# EAGLE design PIC32_Schematic (EAGLE 7.5.0)
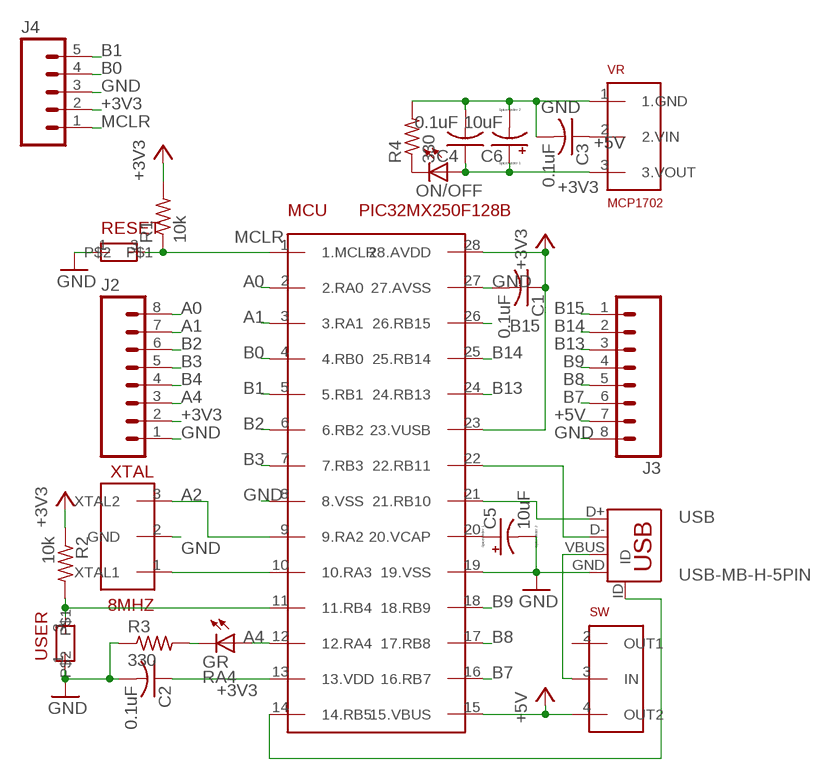
[diagram p0: schematic, sheet 1]

## Parts
8MHZ  XTAL  8MHZ_XTAL  [8MHZ_XTAL]
C1  0.1uF  C-US025-024X044  [C025-024X044]
C2  0.1uF  C-US025-024X044  [C025-024X044]
C3  0.1uF  C-US025-024X044  [C025-024X044]
C4  0.1uF  C-US025-024X044  [C025-024X044]
C5  10uF  CPOL-USE2.5-6  [E2,5-6]
C6  10uF  CPOL-USE2.5-6  [E2,5-6]
GR  RA4  LED3MM  [LED3MM]
J2  M08  [1X08_ROUND]
J3  M08  [1X08_ROUND]
J4  M05PTH  [1X05]
MCU  PIC32MX250F128B  [DIL28-3]
ON/OFF  LED3MM  [LED3MM]
R1  10k  R-US_0207/10  [0207/10]
R2  10k  R-US_0207/10  [0207/10]
R3  330  R-US_0207/10  [0207/10]
R4  330  R-US_0207/10  [0207/10]
RESET  PUSH-BUTTON  [PUSH-BUTTON]
SW  SLIDE_SWITCH  [SLIDE_SWITCH]
USB  USB-MB-H-5PIN  [USB-MB-H]
USER  PUSH-BUTTON  [PUSH-BUTTON]
VR  MCP1702  [TO92]

## Nets
+3V3: C1.1 C2.1 C4.1 C6.+ J2.2 J4.2 MCU.13(13.VDD) MCU.23(23.VUSB) MCU.28(28.AVDD) ON/OFF.A R1.2 R2.1 VR.3(3.VOUT)
+5V: C3.1 J3.7 MCU.15(15.VBUS) SW.4(OUT2) VR.2(2.VIN)
A0: J2.8 MCU.2(2.RA0)
A1: J2.7 MCU.3(3.RA1)
A2: 8MHZ.3(XTAL2) MCU.9(9.RA2)
A3: 8MHZ.1(XTAL1) MCU.10(10.RA3)
A4: GR.A J2.3 MCU.12(12.RA4)
B0: J4.4 MCU.4(4.RB0)
B1: J4.5 MCU.5(5.RB1)
B2: J2.6 MCU.6(6.RB2)
B3: J2.5 MCU.7(7.RB3)
B4: J2.4 MCU.11(11.RB4) R2.2 USER.3
B7: J3.6 MCU.16(16.RB7)
B8: J3.5 MCU.17(17.RB8)
B9: J3.4 MCU.18(18.RB9)
B13: J3.3 MCU.24(24.RB13)
B14: J3.2 MCU.25(25.RB14)
B15: J3.1 MCU.26(26.RB15)
D+: MCU.21(21.RB10) USB.D+
D-: MCU.22(22.RB11) USB.D-
GND: 8MHZ.2(GND) C1.2 C2.2 C3.2 C4.2 C5.- C6.- J2.1 J3.8 J4.3 MCU.8(8.VSS) MCU.19(19.VSS) MCU.27(27.AVSS) R3.1 R4.2 RESET.1 USB.GND USER.1 VR.1(1.GND)
GREENLED: GR.K(C) R3.2
ID: MCU.14(14.RB5) USB.ID
MCLR: J4.1 MCU.1(1.MCLR) R1.1 RESET.3
N$3: ON/OFF.K(C) R4.1
N$9: C5.+ MCU.20(20.VCAP)
VBUS: SW.3(IN) USB.VBUS
Unconnected: SW.2(OUT1)

## Library data of the parts
8MHZ = ME433:8MHZ_XTAL
C1-C4 = ME433:C-US: CAPACITOR, American symbol
C5 C6 = ME433:CPOL-US: POLARIZED CAPACITOR, American symbol
GR ON/OFF = ME433:LED: LED OSRAM: - CHIPLED LG R971, LG N971, LY N971, LG Q971, LY Q971, LO R971, LY R971 LH N974, LH R974 LS Q976, LO Q976, LY Q976 LO Q996 - Hyper CHIPLED LW Q18S LB Q993, LB Q99A, LB R99A - SideLED LS A670, LO A670, LY A670, LG A670, LP A670 LB A673, LV A673, LT A673, LW A673 LH A674 LY A675 LS A676, LA A676, LO A676, LY A676, LW A676 LS A679, LY A679, LG A679 - Hyper Micro SIDELED® LS Y876, LA Y876, LO Y876, LY Y876 LT Y87S - SmartLED LW L88C, LW L88S LB L89C, LB L89S, LG L890 LS L89K, LO L89K, LY L89K LS L896, LA L896, LO L896, LY L896 - TOPLED LS T670, LO T670, LY T670, LG T670, LP T670 LSG T670, LSP T670, LSY T670, LOP T670, LYG T670 LG T671, LOG T671, LSG T671 LB T673, LV T673, LT T673, LW T673 LH T674 LS T676, LA T676, LO T676, LY T676, LB T676, LH T676, LSB T676, LW T676 LB T67C, LV T67C, LT T67C, LS T67K, LO T67K, LY T67K, LW E67C LS E67B, LA E67B, LO E67B, LY E67B, LB E67C, LV E67C, LT E67C LW T67C LS T679, LY T679, LG T679 LS T770, LO T770, LY T770, LG T770, LP T770 LB T773, LV T773, LT T773, LW T773 LH T774 LS E675, LA E675, LY E675, LS T675 LS T776, LA T776, LO T776, LY T776, LB T776 LHGB T686 LT T68C, LB T68C - Hyper Mini TOPLED® LB M676 - Mini TOPLED Santana® LG M470 LS M47K, LO M47K, LY M47K Source: http://www.osram.convergy.de LUXEON: - LUMILED® LXK2-PW12-R00, LXK2-PW12-S00, LXK2-PW14-U00, LXK2-PW14-V00 LXK2-PM12-R00, LXK2-PM12-S00, LXK2-PM14-U00 LXK2-PE12-Q00, LXK2-PE12-R00, LXK2-PE12-S00, LXK2-PE14-T00, LXK2-PE14-U00 LXK2-PB12-K00, LXK2-PB12-L00, LXK2-PB12-M00, LXK2-PB14-N00, LXK2-PB14-P00, LXK2-PB14-Q00 LXK2-PR12-L00, LXK2-PR12-M00, LXK2-PR14-Q00, LXK2-PR14-R00 LXK2-PD12-Q00, LXK2-PD12-R00, LXK2-PD12-S00 LXK2-PH12-R00, LXK2-PH12-S00 LXK2-PL12-P00, LXK2-PL12-Q00, LXK2-PL12-R00 Source: www.luxeon.com KINGBRIGHT: KA-3528ASYC Source: www.kingbright.com
J2 J3 = ME433:M08: Header 8 Standard 8-pin 0.1" header. Use with straight break away headers (SKU : PRT-00116), right angle break away headers (PRT-00553), swiss pins (PRT-00743), machine pins (PRT-00117), and female headers (PRT-00115).; PROD_ID: CONN-08437
J4 = ME433:M05: Header 5 Standard 5-pin 0.1" header. Use with straight break away headers (SKU : PRT-00116), right angle break away headers (PRT-00553), swiss pins (PRT-00743), machine pins (PRT-00117), and female headers (PRT-00115). Molex polarized connector foot print use with SKU : PRT-08230 with associated crimp pins and housings.
MCU = ME433:PIC32MX250F128B
R1-R4 = ME433:R-US_: RESISTOR, American symbol
RESET USER = ME433:PUSH-BUTTON
SW = ME433:SLIDE_SWITCH
USB = ME433:USB-MB-H-5PIN
VR = ME433:MCP1702

## Board
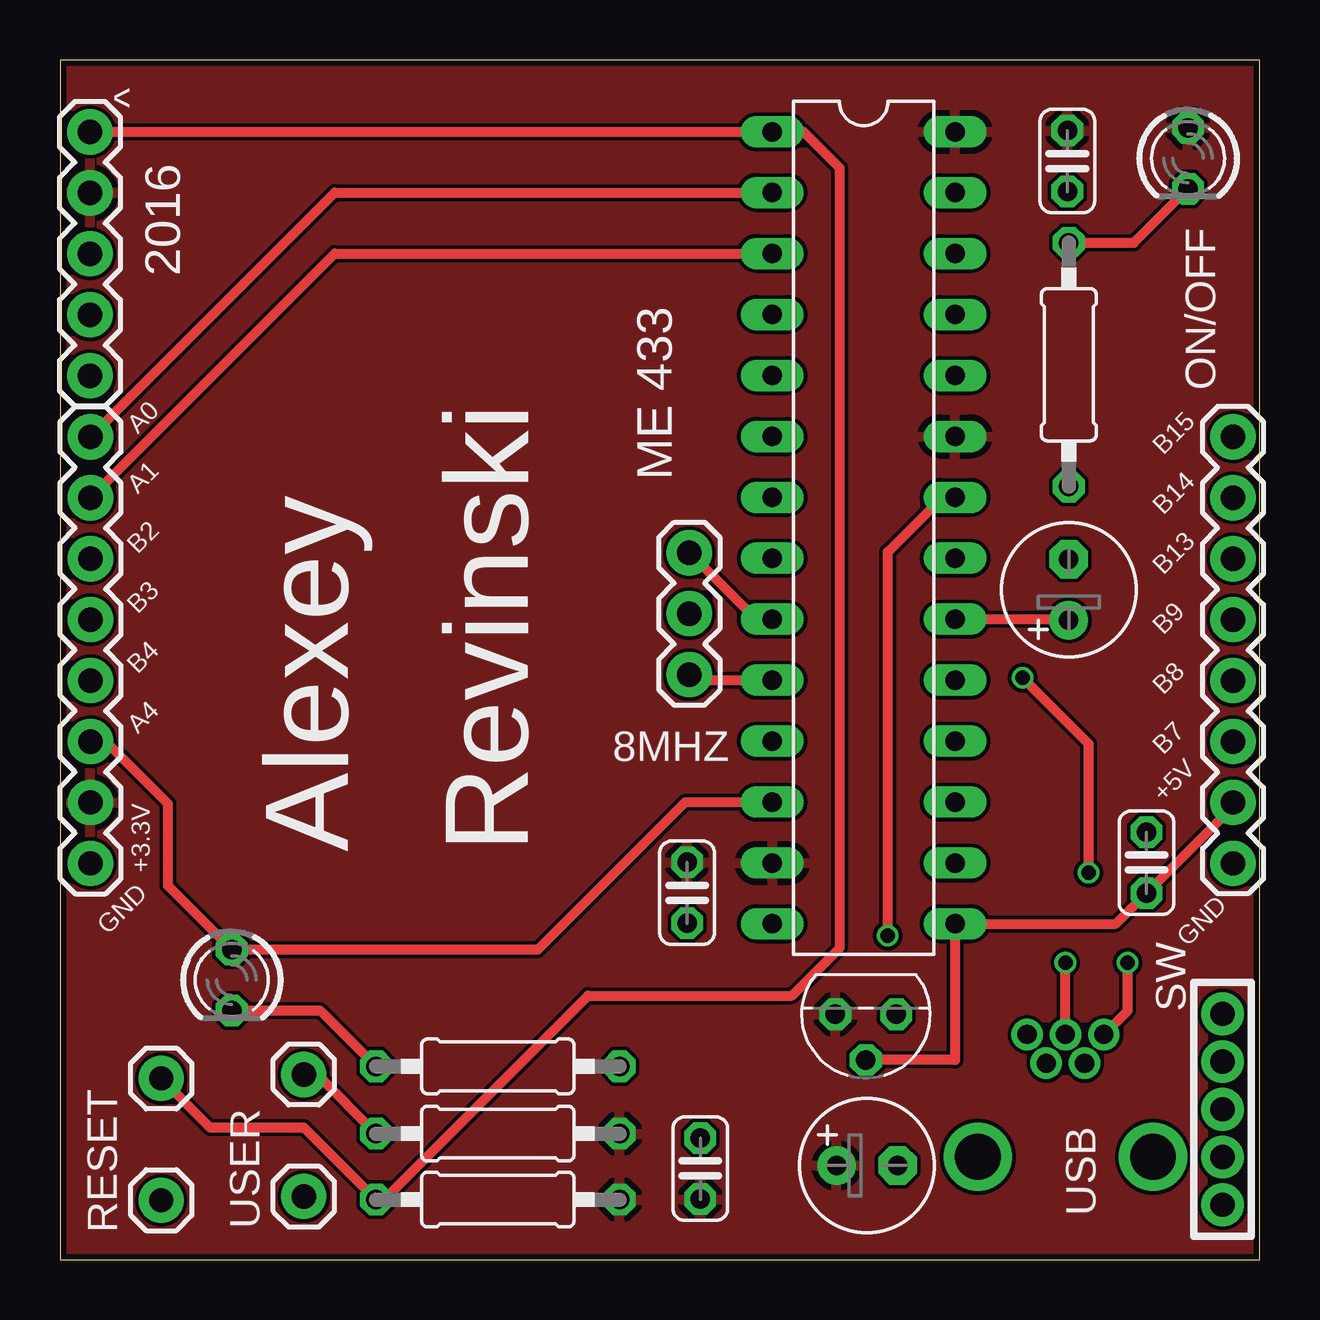
[diagram p1: board, top side]
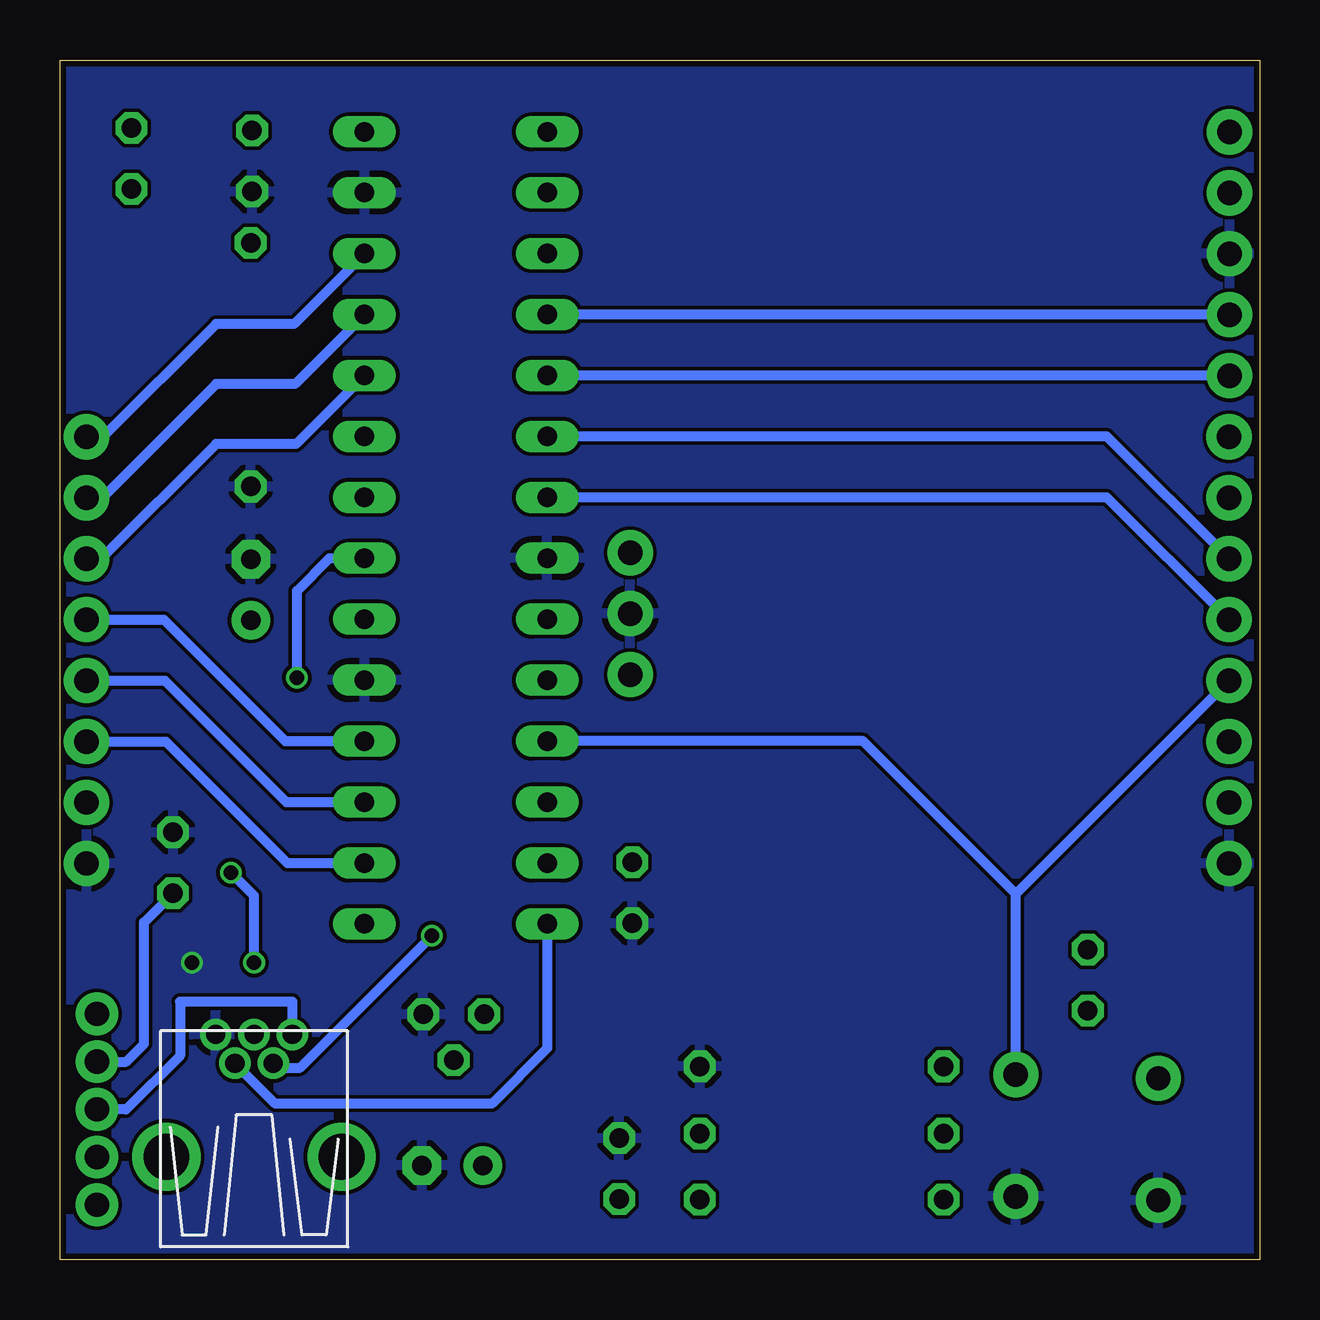
[diagram p2: board, bottom side, seen from below]

Size 50 x 50 mm. Coordinates in mm from the lower left corner, seen from the top.
Outline: 0,0 50,0 50,50 0,50 0,0
Copper layers (1*16): Top 0.035mm / dielectric 1.5mm / GND 0.035mm
Design rules "SeeedStudio_2layer_DRU_no_angle_20140221": minimum track width 6mil, minimum drill 12mil, track to track 6mil, track to pad 6mil, pad to pad 6mil, via to via 6mil, smd to smd 0mil, copper to edge 10mil, drill to drill 10mil, minimum pad ring 10mil, minimum via ring 6mil, stop-mask expansion 2mil, vias tented up to drill 100mil, thermal gap 10mil

### Footprints (pad centres in the part's own frame; a part is rotated, then mirrored left to right if it is on the bottom)
8MHZ_XTAL = drill 1.016 pad 1.88: 1 -2.54,0; 2 0,0; 3 2.54,0
C025-024X044 = drill 0.813 octagon: 1 -1.27,0; 2 1.27,0
E2,5-6 = drill 0.813 pad 1.6: + -1.27,0 | drill 0.813 pad 1.6 octagon: - 1.27,0
LED3MM = drill 0.813 octagon: A -1.27,0; K 1.27,0
1X08_ROUND = drill 1.016 pad 1.88: 1 0,0; 2 2.54,0; 3 5.08,0; 4 7.62,0; 5 10.16,0; 6 12.7,0; 7 15.24,0; 8 17.78,0
1X05 = drill 1.016 pad 1.88: 1 0,0; 2 2.54,0; 3 5.08,0; 4 7.62,0; 5 10.16,0
DIL28-3 = drill 0.813 long: 1 -16.51,-3.81; 2 -13.97,-3.81; 3 -11.43,-3.81; 4 -8.89,-3.81; 5 -6.35,-3.81; 6 -3.81,-3.81; 7 -1.27,-3.81; 8 1.27,-3.81; 9 3.81,-3.81; 10 6.35,-3.81; 11 8.89,-3.81; 12 11.43,-3.81; 13 13.97,-3.81; 14 16.51,-3.81; 15 16.51,3.81; 16 13.97,3.81; 17 11.43,3.81; 18 8.89,3.81; 19 6.35,3.81; 20 3.81,3.81; 21 1.27,3.81; 22 -1.27,3.81; 23 -3.81,3.81; 24 -6.35,3.81; 25 -8.89,3.81; 26 -11.43,3.81; 27 -13.97,3.81; 28 -16.51,3.81
0207/10 = drill 0.813 octagon: 1 -5.08,0; 2 5.08,0
PUSH-BUTTON = drill 1.016 pad 1.88: 1 -2.54,0; 3 2.54,0
SLIDE_SWITCH = drill 1.016 pad 1.778: 1 -3.98,0; 2 -1.99,0; 3 0,0; 4 1.99,0; 5 3.98,0
USB-MB-H = drill 0.8: D+ 5.1,0; D- 3.9,0.8; GND 5.1,-1.6; ID 3.9,-0.8; VBUS 5.1,1.6 | drill 1.9: P$6 0,-3.65; P$7 0,3.65
TO92 = drill 0.813 octagon: 1 -1.27,0; 2 0,1.905; 3 1.27,0

### Placement (x,y rotation side)
8MHZ  26.23,26.92 90 top
C1  41.99,45.79 270 top
C2  26.14,15.29 270 top
C3  45.29,16.54 90 top
C4  26.69,3.79 90 top
C5  42.05,27.92 90 top
C6  33.64,3.92 0 top
GR  7.16,11.65 270 top
J2  1.27,16.51 90 top
J3  48.9,34.29 270 top
J4  1.25,47 270 top
MCU  33.5,30.5 270 top
ON/OFF  47.02,45.9 270 top
R1  18.25,2.5 0 top
R2  18.25,5.25 180 top
R3  18.25,8.05 180 top
R4  42.05,37.3 270 top
RESET  4.22,5.01 90 top
SW  48.46,6.26 90 top
USB  41.91,4.28 90 top
USER  10.16,5.17 90 top
VR  33.59,10.22 180 top

### Tracks (layer width: path | path; a pad name or v marks a point on that pad's centre or on a via)
+3V3
  pour Top: -1,51 -1,-2.5 52,-2.5 52,51.5 -1,51.5
+5V
  Top 0.406: VR.2 37.31,8.31 MCU.15 44.01,13.99 C3.1 45.5,15.5 48.5,18.5 48.5,19 J3.7
  GND 0.406: SW.4 47.25,8.25 46.5,9 46.5,14.06 C3.1
A0
  Top 0.406: J2.8 11.45,44.47 MCU.2
A1
  Top 0.406: MCU.3 11.45,41.93 J2.7
A2
  Top 0.406: 8MHZ.3 29,26.69 MCU.9
A3
  Top 0.406: 8MHZ.1 26.46,24.15 MCU.10
A4
  Top 0.406: MCU.12 26.07,19.07 19.92,12.92 GR.A 4.5,15.58 4.5,19 1.91,21.59 J2.3
B0
  Top 0.406: MCU.4
  GND 0.406: J4.4 MCU.4
B1
  Top 0.406: MCU.5
  GND 0.406: J4.5 MCU.5
B2
  GND 0.406: J2.6 6.37,34.31 MCU.6
B3
  GND 0.406: J2.5 6.37,31.77 MCU.7
B4
  Top 0.406: USER.3 10.71,7.71 R2.2
  GND 0.406: USER.3 10.16,15.24 | 10.16,15.24 J2.4 | 10.16,15.24 16.53,21.61 MCU.11
B7
  GND 0.406: J3.6 45.59,21.59 40.53,16.53 MCU.16
B8
  GND 0.406: J3.5 45.63,24.13 40.57,19.07 MCU.17
B9
  GND 0.406: J3.4 45.67,26.67 40.61,21.61 MCU.18
B13
  GND 0.406: MCU.24 40.16,34 43.5,34 48.29,29.21 J3.3
B14
  GND 0.406: MCU.25 40.2,36.5 43.5,36.5 48.25,31.75 J3.2
B15
  GND 0.406: MCU.26 40.24,39 43.5,39 48.21,34.29 J3.1
D+  (via drill 0.6 pad 0.3)
  Top 0.406: USB.D+ v41.91,12.38 | v42.88,16.12 42.88,21.5 v40.12,24.25
  GND 0.406: v41.91,12.38 41.91,15.16 v42.88,16.12 | v40.12,24.25 40.12,27.88 38.77,29.23 MCU.21
D-  (via drill 0.6)
  Top 0.406: v34.5,13.5 34.5,29.5 36.5,31.5 37,31.5 MCU.22
  GND 0.406: v34.5,13.5 40,8 41,8 USB.D-
GND  (via drill 0.6)
  Top 0.406: USB.GND 44.5,10.37 v44.5,12.38
  pour GND: -2.5,50.5 -2.5,-2 51.5,-2 51.5,-1.5 51.5,51.5 -2.5,51.5
GREENLED
  Top 0.406: GR.K 10.84,10.38 R3.2
ID
  GND 0.406: MCU.14 29.69,8.81 32,6.5 41.03,6.5 USB.ID
MCLR
  Top 0.406: MCU.1 | RESET.3 6.27,5.5 10.17,5.5 R1.1 13.5,2.5 22,11 30.5,11 32.5,13 32.5,45.5 30.99,47.01 MCU.1 | J4.1 MCU.1
N$3
  Top 0.406: R4.1 44.77,42.38 ON/OFF.K
N$9
  Top 0.406: MCU.20 42.01,26.69 C5.+
VBUS
  GND 0.406: SW.3 47.24,6.26 45,8.5 45,10.75 40.31,10.75 USB.VBUS

### Text on the board
tSilk: ^ | 2016 | A0 | B15 | A1 | ME 433 | B14 | B2 | B13 | B3 | B9 | B4 | B8 | A4 | B7 | +5V | Alexey | Revinski | +3.3V | GND | GND